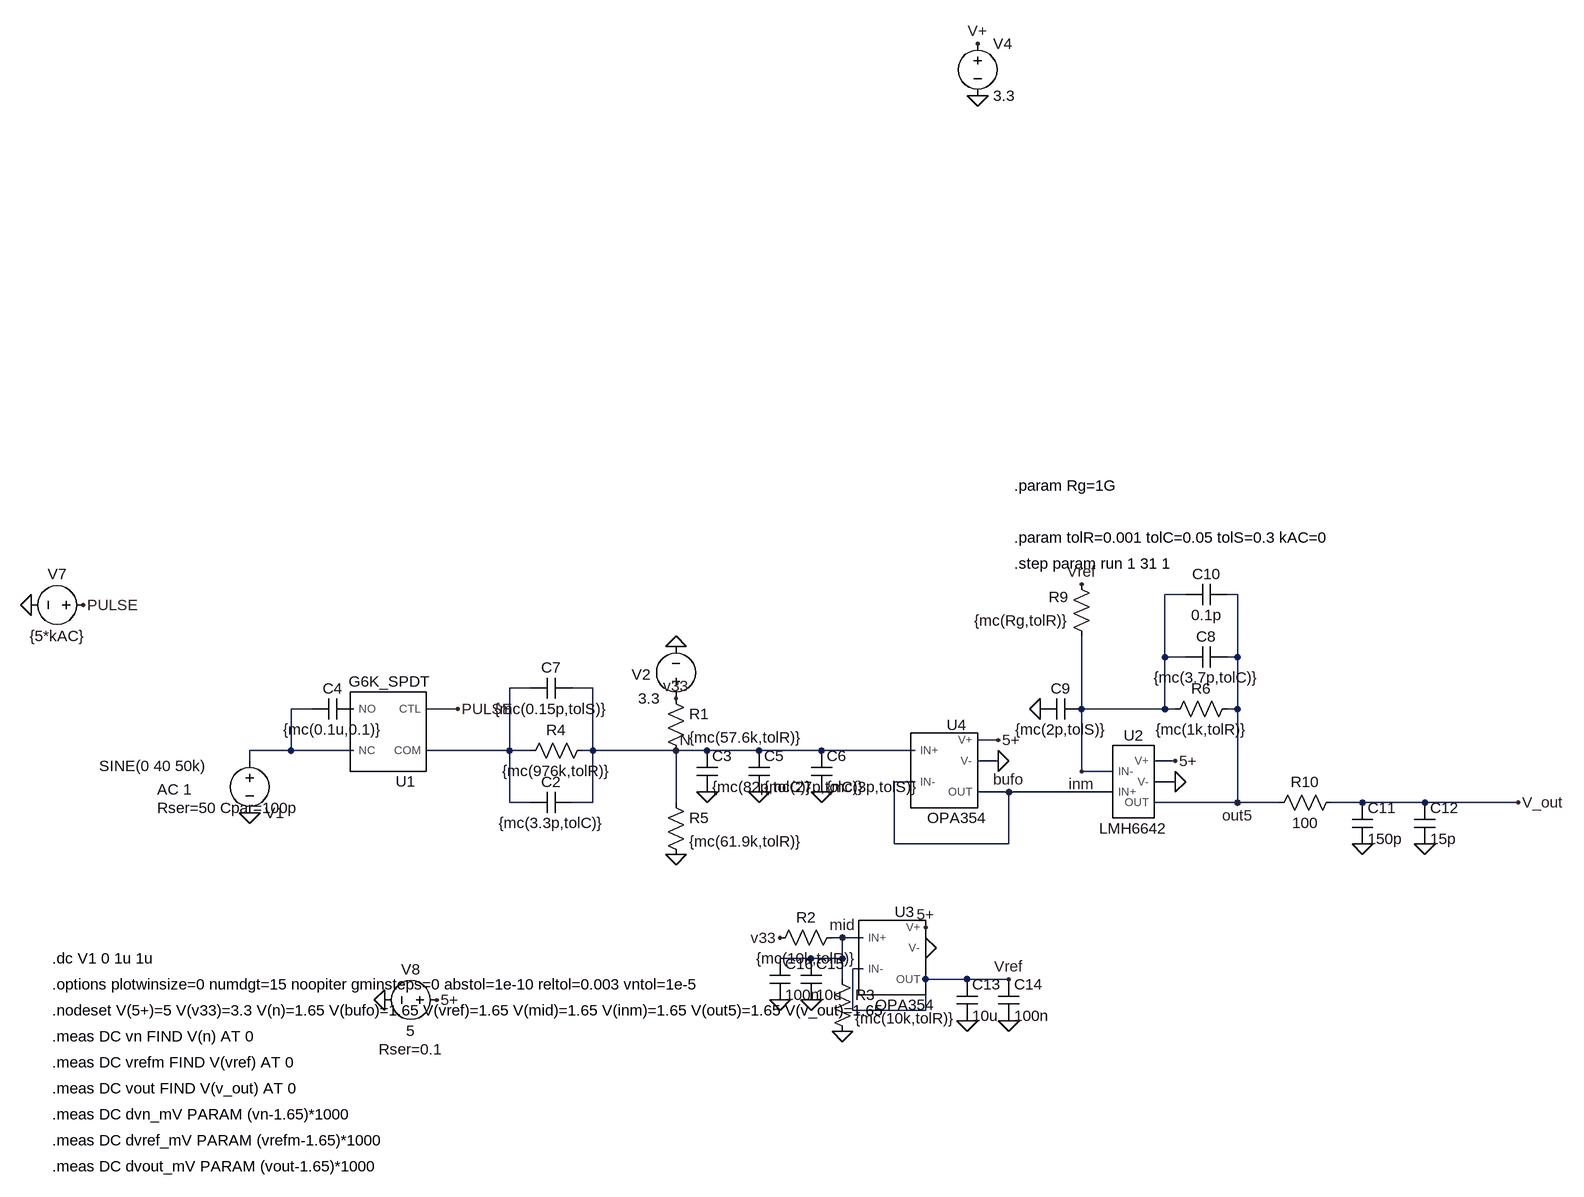
[diagram p0: schematic Analog Front End_MC_OP.asc]
Analog Front End_MC_OP.asc, the LTspice schematic file:
Version 4
SHEET 1 2100 680
WIRE 1440 -80 1408 -80
WIRE 1520 -80 1504 -80
WIRE 1408 16 1408 -80
WIRE 1440 16 1408 16
WIRE 1520 16 1520 -80
WIRE 1520 16 1504 16
WIRE 432 64 400 64
WIRE 528 64 496 64
WIRE 96 96 64 96
WIRE 320 96 272 96
WIRE 1280 96 1280 -16
WIRE 1408 96 1408 16
WIRE 1408 96 1280 96
WIRE 1424 96 1408 96
WIRE 1520 96 1520 16
WIRE 1520 96 1504 96
WIRE 1152 144 1120 144
WIRE 64 160 64 96
WIRE 64 160 0 160
WIRE 160 160 64 160
WIRE 400 160 400 64
WIRE 400 160 272 160
WIRE 432 160 400 160
WIRE 528 160 528 64
WIRE 528 160 512 160
WIRE 656 160 528 160
WIRE 704 160 656 160
WIRE 784 160 704 160
WIRE 880 160 784 160
WIRE 1024 160 880 160
WIRE 0 176 0 160
WIRE 1152 176 1120 176
WIRE 1424 176 1392 176
WIRE 1280 192 1280 96
WIRE 1328 192 1280 192
WIRE 1024 208 992 208
WIRE 1424 208 1392 208
WIRE 1168 224 1120 224
WIRE 1328 224 1168 224
WIRE 400 240 400 160
WIRE 432 240 400 240
WIRE 528 240 528 160
WIRE 528 240 496 240
WIRE 656 240 656 160
WIRE 1520 240 1520 96
WIRE 1520 240 1392 240
WIRE 1584 240 1520 240
WIRE 1712 240 1664 240
WIRE 1808 240 1712 240
WIRE 1952 240 1808 240
WIRE 992 304 992 208
WIRE 1168 304 1168 224
WIRE 1168 304 992 304
WIRE 912 448 896 448
WIRE 944 448 912 448
WIRE 912 480 912 448
WIRE 912 512 912 480
WIRE 864 480 912 480
WIRE 816 480 864 480
WIRE 1040 512 1040 560
WIRE 1040 560 928 560
WIRE 928 560 928 496
WIRE 928 496 944 496
WIRE 1104 512 1040 512
WIRE 1168 512 1104 512
FLAG 656 0 0
FLAG 912 592 0
FLAG 656 320 0
FLAG 0 256 0
FLAG 1952 240 V_out
FLAG 1120 -928 V+
FLAG 1120 -848 0
FLAG 704 224 0
FLAG -256 -64 PULSE
FLAG -336 -64 0
FLAG 288 544 5+
FLAG 208 544 0
FLAG 320 96 PULSE
FLAG 784 224 0
FLAG 1152 144 5+
FLAG 1152 176 0
FLAG 880 224 0
FLAG 1424 176 5+
FLAG 1424 208 0
FLAG 1216 96 0
FLAG 1280 -96 Vref
FLAG 1712 304 0
FLAG 1808 304 0
FLAG 656 160 N
FLAG 1168 224 bufo
FLAG 1280 192 inm
FLAG 1520 240 out5
FLAG 912 448 mid
FLAG 656 80 v33
FLAG 816 448 v33
FLAG 1040 432 5+
FLAG 1040 464 0
FLAG 1168 512 Vref
FLAG 864 544 0
FLAG 816 544 0
FLAG 1104 576 0
FLAG 1168 576 0
SYMBOL voltage 656 96 R180
WINDOW 0 39 53 Left 2
WINDOW 3 24 16 Left 2
WINDOW 123 0 0 Left 0
WINDOW 39 0 0 Left 0
SYMATTR InstName V2
SYMATTR Value 3.3
SYMBOL res 640 64 R0
SYMATTR InstName R1
SYMATTR Value {mc(57.6k,tolR)}
SYMBOL res 912 432 R90
WINDOW 0 0 56 VBottom 2
WINDOW 3 32 56 VTop 2
SYMATTR InstName R2
SYMATTR Value {mc(10k,tolR)}
SYMBOL res 896 496 R0
SYMATTR InstName R3
SYMATTR Value {mc(10k,tolR)}
SYMBOL res 528 144 R90
WINDOW 0 0 56 VBottom 2
WINDOW 3 32 56 VTop 2
SYMATTR InstName R4
SYMATTR Value {mc(976k,tolR)}
SYMBOL res 640 224 R0
SYMATTR InstName R5
SYMATTR Value {mc(61.9k,tolR)}
SYMBOL voltage 1120 -944 R0
WINDOW 123 0 0 Left 0
WINDOW 39 0 0 Left 0
SYMATTR InstName V4
SYMATTR Value 3.3
SYMBOL voltage 0 160 R0
WINDOW 0 24 96 Left 2
WINDOW 3 -231 24 Left 2
WINDOW 123 -142 60 Left 2
WINDOW 39 -142 88 Left 2
SYMATTR InstName V1
SYMATTR Value SINE(0 40 50k)
SYMATTR Value2 AC 1
SYMATTR SpiceLine Rser=50 Cpar=100p
SYMBOL cap 688 160 R0
SYMATTR InstName C3
SYMATTR Value {mc(82p,tolC)}
SYMATTR SpiceLine Rser=0.3 Lser=0.7n
SYMBOL LMH6642 1360 208 R0
SYMATTR InstName U2
SYMBOL voltage -240 -64 R90
WINDOW 0 -32 56 VBottom 2
WINDOW 3 32 56 VTop 2
WINDOW 123 0 0 Left 0
WINDOW 39 0 0 Left 0
SYMATTR InstName V7
SYMATTR Value {5*kAC}
SYMBOL voltage 304 544 R90
WINDOW 0 -32 56 VBottom 2
WINDOW 3 32 56 VTop 2
WINDOW 123 0 0 Left 0
WINDOW 39 60 56 VTop 2
SYMATTR InstName V8
SYMATTR Value 5
SYMATTR SpiceLine Rser=0.1
SYMBOL OPA354 1088 192 R0
SYMATTR InstName U4
SYMBOL G6K_SPDT 240 144 R180
SYMATTR InstName U1
SYMBOL cap 160 80 R90
WINDOW 0 0 32 VBottom 2
WINDOW 3 32 32 VTop 2
SYMATTR InstName C4
SYMATTR Value {mc(0.1u,0.1)}
SYMATTR SpiceLine V=100 Irms=0 Rser=0.03 Lser=0.8n Rpar=1G
SYMBOL cap 768 160 R0
SYMATTR InstName C5
SYMATTR Value {mc(27p,tolC)}
SYMATTR SpiceLine Rser=1 Lser=1n
SYMBOL cap 496 224 R90
WINDOW 0 0 32 VBottom 2
WINDOW 3 32 32 VTop 2
SYMATTR InstName C2
SYMATTR Value {mc(3.3p,tolC)}
SYMATTR SpiceLine Rser=1 Lser=0.5n
SYMBOL cap 496 48 R90
WINDOW 0 0 32 VBottom 2
WINDOW 3 32 32 VTop 2
SYMATTR InstName C7
SYMATTR Value {mc(0.15p,tolS)}
SYMBOL cap 864 160 R0
SYMATTR InstName C6
SYMATTR Value {mc(3p,tolS)}
SYMBOL res 1520 80 R90
WINDOW 0 0 56 VBottom 2
WINDOW 3 32 56 VTop 2
SYMATTR InstName R6
SYMATTR Value {mc(1k,tolR)}
SYMBOL cap 1504 0 R90
WINDOW 0 0 32 VBottom 2
WINDOW 3 32 32 VTop 2
SYMATTR InstName C8
SYMATTR Value {mc(3.7p,tolC)}
SYMATTR SpiceLine Rser=0.2 Lser=0.5n
SYMBOL cap 1280 80 R90
WINDOW 0 0 32 VBottom 2
WINDOW 3 32 32 VTop 2
SYMATTR InstName C9
SYMATTR Value {mc(2p,tolS)}
SYMBOL cap 1504 -96 R90
WINDOW 0 0 32 VBottom 2
WINDOW 3 32 32 VTop 2
SYMATTR InstName C10
SYMATTR Value 0.1p
SYMBOL res 1296 0 R180
WINDOW 0 36 76 Left 2
WINDOW 3 36 40 Left 2
SYMATTR InstName R9
SYMATTR Value {mc(Rg,tolR)}
SYMBOL res 1680 224 R90
WINDOW 0 0 56 VBottom 2
WINDOW 3 32 56 VTop 2
SYMATTR InstName R10
SYMATTR Value 100
SYMBOL cap 1696 240 R0
SYMATTR InstName C11
SYMATTR Value 150p
SYMATTR SpiceLine Rser=0.2 Lser=0.7n
SYMBOL cap 1792 240 R0
SYMATTR InstName C12
SYMATTR Value 15p
SYMBOL OPA354 1008 480 R0
SYMATTR InstName U3
SYMBOL cap 848 480 R0
SYMATTR InstName C15
SYMATTR Value 10u
SYMATTR SpiceLine Rser=0.02 Lser=1.5n
SYMBOL cap 800 480 R0
SYMATTR InstName C16
SYMATTR Value 100n
SYMATTR SpiceLine Rser=0.05 Lser=0.7n
SYMBOL cap 1088 512 R0
SYMATTR InstName C13
SYMATTR Value 10u
SYMATTR SpiceLine Rser=0.02 Lser=1.5n
SYMBOL cap 1152 512 R0
SYMATTR InstName C14
SYMATTR Value 100n
SYMATTR SpiceLine Rser=0.05 Lser=0.7n
TEXT 1176 -248 Left 2 !.param Rg=1G
TEXT -304 520 Left 2 !.options plotwinsize=0 numdgt=15 noopiter gminsteps=0 abstol=1e-10 reltol=0.003 vntol=1e-5
TEXT -304 560 Left 2 !.nodeset V(5+)=5 V(v33)=3.3 V(n)=1.65 V(bufo)=1.65 V(vref)=1.65 V(mid)=1.65 V(inm)=1.65 V(out5)=1.65 V(v_out)=1.65
TEXT 1176 -168 Left 2 !.param tolR=0.001 tolC=0.05 tolS=0.3 kAC=0
TEXT 1176 -128 Left 2 !.step param run 1 31 1
TEXT -304 480 Left 2 !.dc V1 0 1u 1u
TEXT -304 600 Left 2 !.meas DC vn FIND V(n) AT 0
TEXT -304 640 Left 2 !.meas DC vrefm FIND V(vref) AT 0
TEXT -304 680 Left 2 !.meas DC vout FIND V(v_out) AT 0
TEXT -304 720 Left 2 !.meas DC dvn_mV PARAM (vn-1.65)*1000
TEXT -304 760 Left 2 !.meas DC dvref_mV PARAM (vrefm-1.65)*1000
TEXT -304 800 Left 2 !.meas DC dvout_mV PARAM (vout-1.65)*1000

The netlist it stands for:
* Analog Front End_MC_OP.asc
V2 v33 0 3.3
R1 v33 N {mc(57.6k,tolR)}
R2 mid v33 {mc(10k,tolR)}
R3 mid 0 {mc(10k,tolR)}
R4 N N001 {mc(976k,tolR)}
R5 N 0 {mc(61.9k,tolR)}
V4 V+ 0 3.3
V1 N002 0 SINE(0 40 50k) AC 1 Rser=50 Cpar=100p
C3 N 0 {mc(82p,tolC)} Rser=0.3 Lser=0.7n
XU2 inm bufo 5+ 0 out5 LMH6642  ; pins IN- IN+ V+ V- OUT
V7 PULSE 0 {5*kAC}
V8 5+ 0 5 Rser=0.1
XU4 N bufo 5+ 0 bufo OPA354  ; pins IN+ IN- V+ V- OUT
XU1 N001 N002 P001 PULSE G6K_SPDT  ; pins COM NC NO CTL
C4 P001 N002 {mc(0.1u,0.1)} V=100 Irms=0 Rser=0.03 Lser=0.8n Rpar=1G
C5 N 0 {mc(27p,tolC)} Rser=1 Lser=1n
C2 N N001 {mc(3.3p,tolC)} Rser=1 Lser=0.5n
C7 N N001 {mc(0.15p,tolS)}
C6 N 0 {mc(3p,tolS)}
R6 out5 inm {mc(1k,tolR)}
C8 out5 inm {mc(3.7p,tolC)} Rser=0.2 Lser=0.5n
C9 inm 0 {mc(2p,tolS)}
C10 out5 inm 0.1p
R9 inm Vref {mc(Rg,tolR)}
R10 V_out out5 100
C11 V_out 0 150p Rser=0.2 Lser=0.7n
C12 V_out 0 15p
XU3 mid Vref 5+ 0 Vref OPA354  ; pins IN+ IN- V+ V- OUT
C15 mid 0 10u Rser=0.02 Lser=1.5n
C16 mid 0 100n Rser=0.05 Lser=0.7n
C13 Vref 0 10u Rser=0.02 Lser=1.5n
C14 Vref 0 100n Rser=0.05 Lser=0.7n
.param Rg=1G
.options plotwinsize=0 numdgt=15 noopiter gminsteps=0 abstol=1e-10 reltol=0.003 vntol=1e-5
.nodeset V(5+)=5 V(v33)=3.3 V(n)=1.65 V(bufo)=1.65 V(vref)=1.65 V(mid)=1.65 V(inm)=1.65 V(out5)=1.65 V(v_out)=1.65
.param tolR=0.001 tolC=0.05 tolS=0.3 kAC=0
.step param run 1 31 1
.dc V1 0 1u 1u
.meas DC vn FIND V(n) AT 0
.meas DC vrefm FIND V(vref) AT 0
.meas DC vout FIND V(v_out) AT 0
.meas DC dvn_mV PARAM (vn-1.65)*1000
.meas DC dvref_mV PARAM (vrefm-1.65)*1000
.meas DC dvout_mV PARAM (vout-1.65)*1000
.lib C:\Users\polus\OneDrive\Pulpit\Projekty\Oscyloskop\Symulacje\LMH6642.MOD
.lib C:\Users\polus\OneDrive\Pulpit\Projekty\Oscyloskop\Symulacje\sboc018c\OPA354-PSpiceFiles\SCHEMATIC1\TransientSimulation\OPA354.lib
.lib C:\Users\polus\OneDrive\Pulpit\Projekty\Oscyloskop\Symulacje\G6K_SPDT.lib
.backanno
.end